# Altium schematic sheet SENSORS.SchDoc
size A3
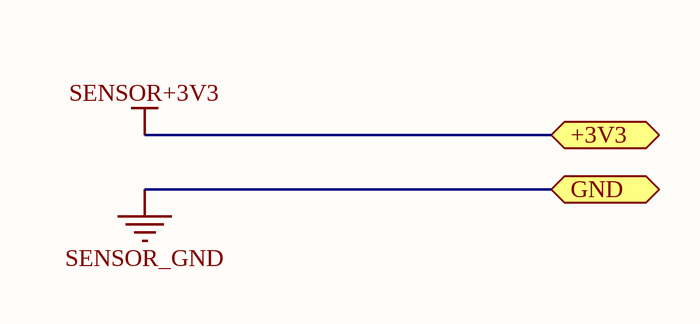
[diagram p0: SENSORS.SchDoc]

## Ports
+3V3 (bidir), GND (bidir)

## Nets
SENSOR+3V3: port +3V3
SENSOR_GND: port GND

## Notes on the sheet
- Tarih/Date
- Kont/Check
- Onay/Appr
- Haz/Prep
- Ortam/Env
- Sayfa/Sht
- Form
- /
- Deg Tarihi/Chng Date
- Deg Onay/Chng Appr
- Rev
- All rights reserved. No part of this document may be reproduced or transmitted in any form or by any means, electronic, mechanical, photocopying, recording, or otherwise, without prior written permission of